# Altium schematic sheet IPMC_UnderTesting.SchDoc
size A3; Author: Marcelo Vicente; Organization: Univ. of Wisconsin-Madison; Address1: Madison, WI 53706; DocumentNumber: 3; SheetNumber: 3; SheetTotal: 5
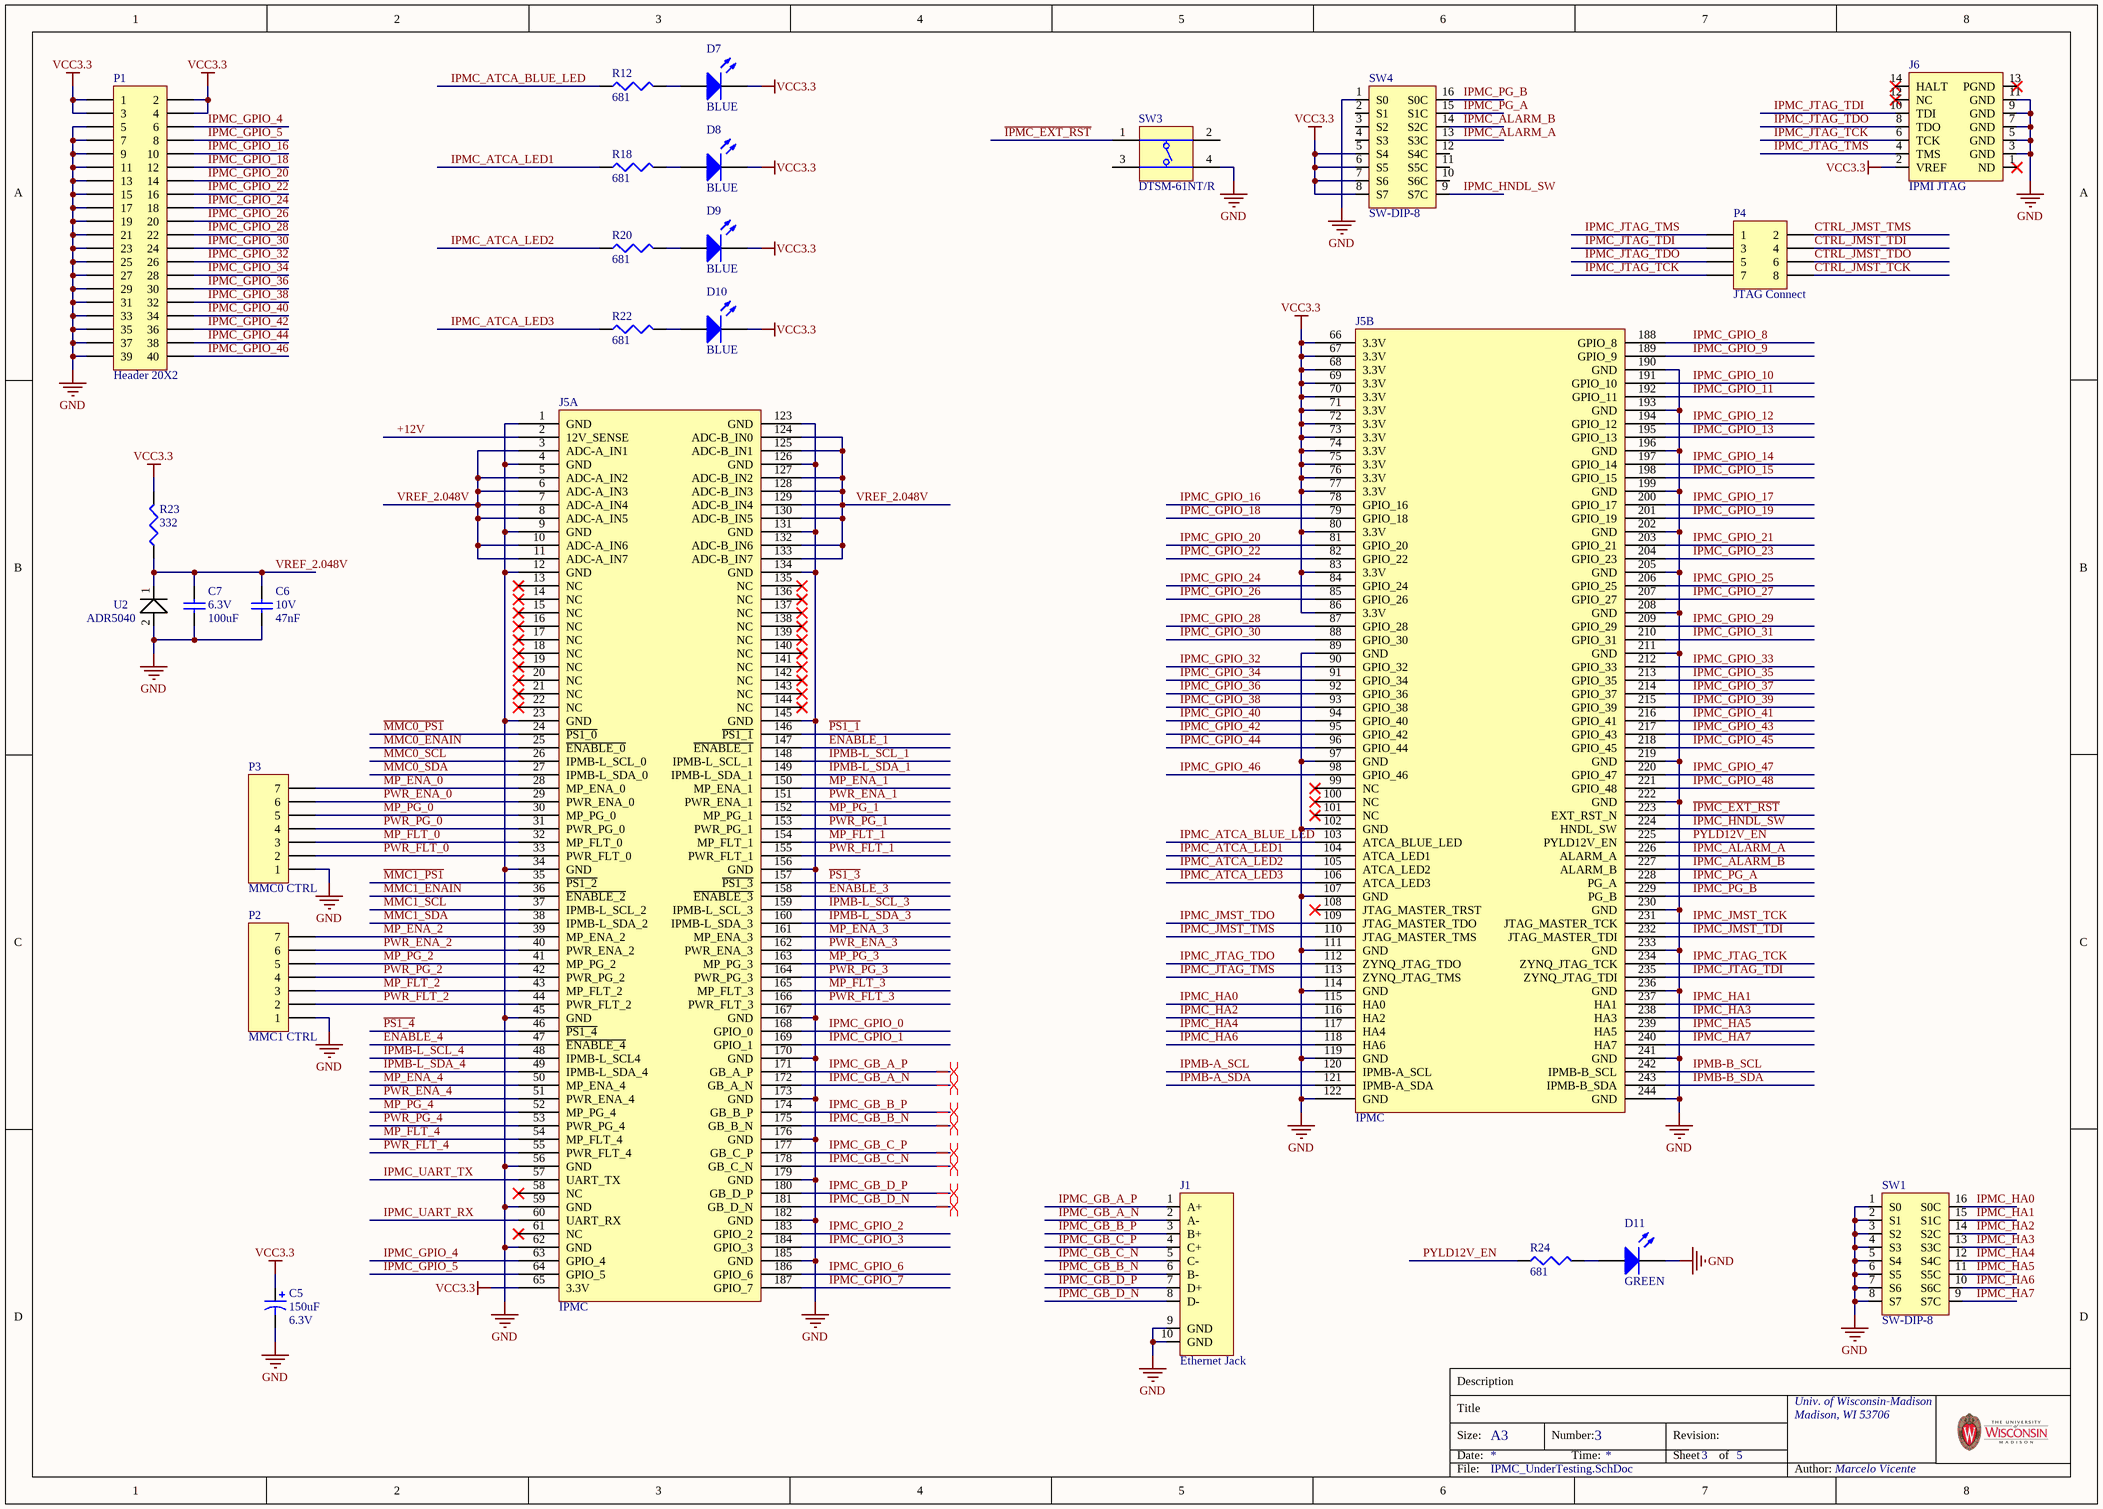
[diagram p0: IPMC_UnderTesting.SchDoc]

## Parts
C5  value 150uF  Rating: 6.3V  [VISH-293D-7343-31_V]  (hidden comment: ?)
C6  value 47nF  Rating: 10V  [C0402_IPC_H]  (hidden comment: ?)
C7  value 100uF  Rating: 6.3V  [C1210_IPC_H]  (hidden comment: ?)
D7  BLUE  [LED0603_M]
D8  BLUE  [LED0603_M]
D9  BLUE  [LED0603_M]
D10  BLUE  [LED0603_M]
D11  GREEN  [LED0603_M]
J1  Ethernet Jack  [43202-8916]
J5  IPMC  [87782-3007]  (parts A,B of 2)
J6  IPMI JTAG  [87832-1420]
P1  Header 20X2  [HEADER2X20]
P2  MMC1 CTRL  [HEADER1X7]
P3  MMC0 CTRL  [HEADER1X7]
P4  JTAG Connect  [HEADER2X4]
R12  value 681  [R0603]  (hidden comment: ?)
R18  value 681  [R0603]  (hidden comment: ?)
R20  value 681  [R0603]  (hidden comment: ?)
R22  value 681  [R0603]  (hidden comment: ?)
R23  value 332  [R0402_IPC_H]  (hidden comment: ?)
R24  value 681  [R0603]  (hidden comment: ?)
SW1  SW-DIP-8  [TDA08H0]
SW3  DTSM-61NT/R  [DIPT-DTSM-6_V]
SW4  SW-DIP-8  [TDA08H0]
U2  ADR5040  [SOT23-H]

## Nets
GND: C5.2 C6.1 C7.1 D11.2(K) J1.9(GND) J1.10(GND) J5.1(GND) J5.4(GND) J5.9(GND) J5.12(GND) J5.23(GND) J5.34(GND) J5.45(GND) J5.56(GND) J5.59(GND) J5.62(GND) J5.89(GND) J5.97(GND) J5.102(GND) J5.107(GND) J5.111(GND) J5.114(GND) J5.119(GND) J5.122(GND) J5.123(GND) J5.126(GND) J5.131(GND) J5.134(GND) J5.145(GND) J5.156(GND) J5.167(GND) J5.170(GND) J5.173(GND) J5.176(GND) J5.179(GND) J5.182(GND) J5.185(GND) J5.190(GND) J5.193(GND) J5.196(GND) J5.199(GND) J5.202(GND) J5.205(GND) J5.208(GND) J5.211(GND) J5.219(GND) J5.222(GND) J5.230(GND) J5.233(GND) J5.236(GND) J5.241(GND) J5.244(GND) J6.3(GND) J6.5(GND) J6.7(GND) J6.9(GND) J6.11(GND) P1.5 P1.7 P1.9 P1.11 P1.13 P1.15 P1.17 P1.19 P1.21 P1.23 P1.25 P1.27 P1.29 P1.31 P1.33 P1.35 P1.37 P1.39 P2.1 P3.1 SW1.1(S0) SW1.2(S1) SW1.3(S2) SW1.4(S3) SW1.5(S4) SW1.6(S5) SW1.7(S6) SW1.8(S7) SW3.4(T3) SW4.1(S0) U2.2(V+)
VCC3.3: C5.1 D7.2(K) D8.2(K) D9.2(K) D10.2(K) J5.65(3.3V) J5.66(3.3V) J5.67(3.3V) J5.68(3.3V) J5.69(3.3V) J5.70(3.3V) J5.71(3.3V) J5.72(3.3V) J5.73(3.3V) J5.74(3.3V) J5.75(3.3V) J5.76(3.3V) J5.77(3.3V) J5.80(3.3V) J5.83(3.3V) J5.86(3.3V) J6.2(VREF) P1.1 P1.2 P1.3 P1.4 R23.2 SW4.5(S4) SW4.6(S5) SW4.7(S6) SW4.8(S7)
+12V: J5.2(12V_SENSE)
~{ENABLE_1}: J5.147(~{ENABLE_1})
~{ENABLE_3}: J5.158(~{ENABLE_3})
~{ENABLE_4}: J5.47(~{ENABLE_4})
~{IPMC_EXT_RST}: J5.223(EXT_RST_N) SW3.1(T1)
~{MMC0_ENAIN}: J5.25(~{ENABLE_0})
~{MMC0_PS1}: J5.24(~{PS1_0})
~{MMC1_ENAIN}: J5.36(~{ENABLE_2})
~{MMC1_PS1}: J5.35(~{PS1_2})
~{PS1_1}: J5.146(~{PS1_1})
~{PS1_3}: J5.157(~{PS1_3})
~{PS1_4}: J5.46(~{PS1_4})
CTRL_JMST_TCK: P4.8
CTRL_JMST_TDI: P4.4
CTRL_JMST_TDO: P4.6
CTRL_JMST_TMS: P4.2
IPMB-A_SCL: J5.120(IPMB-A_SCL)
IPMB-A_SDA: J5.121(IPMB-A_SDA)
IPMB-B_SCL: J5.242(IPMB-B_SCL)
IPMB-B_SDA: J5.243(IPMB-B_SDA)
IPMB-L_SCL_1: J5.148(IPMB-L_SCL_1)
IPMB-L_SCL_3: J5.159(IPMB-L_SCL_3)
IPMB-L_SCL_4: J5.48(IPMB-L_SCL4)
IPMB-L_SDA_1: J5.149(IPMB-L_SDA_1)
IPMB-L_SDA_3: J5.160(IPMB-L_SDA_3)
IPMB-L_SDA_4: J5.49(IPMB-L_SDA_4)
IPMC_ALARM_A: J5.226(ALARM_A) SW4.13(S3C)
IPMC_ALARM_B: J5.227(ALARM_B) SW4.14(S2C)
IPMC_ATCA_BLUE_LED: J5.103(ATCA_BLUE_LED) R12.1
IPMC_ATCA_LED1: J5.104(ATCA_LED1) R18.1
IPMC_ATCA_LED2: J5.105(ATCA_LED2) R20.1
IPMC_ATCA_LED3: J5.106(ATCA_LED3) R22.1
IPMC_GB_A_N: J1.2(A-) J5.172(GB_A_N)
IPMC_GB_A_P: J1.1(A+) J5.171(GB_A_P)
IPMC_GB_B_N: J1.6(B-) J5.175(GB_B_N)
IPMC_GB_B_P: J1.3(B+) J5.174(GB_B_P)
IPMC_GB_C_N: J1.5(C-) J5.178(GB_C_N)
IPMC_GB_C_P: J1.4(C+) J5.177(GB_C_P)
IPMC_GB_D_N: J1.8(D-) J5.181(GB_D_N)
IPMC_GB_D_P: J1.7(D+) J5.180(GB_D_P)
IPMC_GPIO_0: J5.168(GPIO_0)
IPMC_GPIO_1: J5.169(GPIO_1)
IPMC_GPIO_2: J5.183(GPIO_2)
IPMC_GPIO_3: J5.184(GPIO_3)
IPMC_GPIO_4: J5.63(GPIO_4) P1.6
IPMC_GPIO_5: J5.64(GPIO_5) P1.8
IPMC_GPIO_6: J5.186(GPIO_6)
IPMC_GPIO_7: J5.187(GPIO_7)
IPMC_GPIO_8: J5.188(GPIO_8)
IPMC_GPIO_9: J5.189(GPIO_9)
IPMC_GPIO_10: J5.191(GPIO_10)
IPMC_GPIO_11: J5.192(GPIO_11)
IPMC_GPIO_12: J5.194(GPIO_12)
IPMC_GPIO_13: J5.195(GPIO_13)
IPMC_GPIO_14: J5.197(GPIO_14)
IPMC_GPIO_15: J5.198(GPIO_15)
IPMC_GPIO_16: J5.78(GPIO_16) P1.10
IPMC_GPIO_17: J5.200(GPIO_17)
IPMC_GPIO_18: J5.79(GPIO_18) P1.12
IPMC_GPIO_19: J5.201(GPIO_19)
IPMC_GPIO_20: J5.81(GPIO_20) P1.14
IPMC_GPIO_21: J5.203(GPIO_21)
IPMC_GPIO_22: J5.82(GPIO_22) P1.16
IPMC_GPIO_23: J5.204(GPIO_23)
IPMC_GPIO_24: J5.84(GPIO_24) P1.18
IPMC_GPIO_25: J5.206(GPIO_25)
IPMC_GPIO_26: J5.85(GPIO_26) P1.20
IPMC_GPIO_27: J5.207(GPIO_27)
IPMC_GPIO_28: J5.87(GPIO_28) P1.22
IPMC_GPIO_29: J5.209(GPIO_29)
IPMC_GPIO_30: J5.88(GPIO_30) P1.24
IPMC_GPIO_31: J5.210(GPIO_31)
IPMC_GPIO_32: J5.90(GPIO_32) P1.26
IPMC_GPIO_33: J5.212(GPIO_33)
IPMC_GPIO_34: J5.91(GPIO_34) P1.28
IPMC_GPIO_35: J5.213(GPIO_35)
IPMC_GPIO_36: J5.92(GPIO_36) P1.30
IPMC_GPIO_37: J5.214(GPIO_37)
IPMC_GPIO_38: J5.93(GPIO_38) P1.32
IPMC_GPIO_39: J5.215(GPIO_39)
IPMC_GPIO_40: J5.94(GPIO_40) P1.34
IPMC_GPIO_41: J5.216(GPIO_41)
IPMC_GPIO_42: J5.95(GPIO_42) P1.36
IPMC_GPIO_43: J5.217(GPIO_43)
IPMC_GPIO_44: J5.96(GPIO_44) P1.38
IPMC_GPIO_45: J5.218(GPIO_45)
IPMC_GPIO_46: J5.98(GPIO_46) P1.40
IPMC_GPIO_47: J5.220(GPIO_47)
IPMC_GPIO_48: J5.221(GPIO_48)
IPMC_HA0: J5.115(HA0) SW1.16(S0C)
IPMC_HA1: J5.237(HA1) SW1.15(S1C)
IPMC_HA2: J5.116(HA2) SW1.14(S2C)
IPMC_HA3: J5.238(HA3) SW1.13(S3C)
IPMC_HA4: J5.117(HA4) SW1.12(S4C)
IPMC_HA5: J5.239(HA5) SW1.11(S5C)
IPMC_HA6: J5.118(HA6) SW1.10(S6C)
IPMC_HA7: J5.240(HA7) SW1.9(S7C)
IPMC_HNDL_SW: J5.224(HNDL_SW) SW4.9(S7C)
IPMC_JMST_TCK: J5.231(JTAG_MASTER_TCK)
IPMC_JMST_TDI: J5.232(JTAG_MASTER_TDI)
IPMC_JMST_TDO: J5.109(JTAG_MASTER_TDO)
IPMC_JMST_TMS: J5.110(JTAG_MASTER_TMS)
IPMC_JTAG_TCK: J5.234(ZYNQ_JTAG_TCK) J6.6(TCK) P4.7
IPMC_JTAG_TDI: J5.235(ZYNQ_JTAG_TDI) J6.10(TDI) P4.3
IPMC_JTAG_TDO: J5.112(ZYNQ_JTAG_TDO) J6.8(TDO) P4.5
IPMC_JTAG_TMS: J5.113(ZYNQ_JTAG_TMS) J6.4(TMS) P4.1
IPMC_PG_A: J5.228(PG_A) SW4.15(S1C)
IPMC_PG_B: J5.229(PG_B) SW4.16(S0C)
IPMC_UART_RX: J5.60(UART_RX)
IPMC_UART_TX: J5.57(UART_TX)
MMC0_SCL: J5.26(IPMB-L_SCL_0)
MMC0_SDA: J5.27(IPMB-L_SDA_0)
MMC1_SCL: J5.37(IPMB-L_SCL_2)
MMC1_SDA: J5.38(IPMB-L_SDA_2)
MP_ENA_0: J5.28(MP_ENA_0) P3.7
MP_ENA_1: J5.150(MP_ENA_1)
MP_ENA_2: J5.39(MP_ENA_2) P2.7
MP_ENA_3: J5.161(MP_ENA_3)
MP_ENA_4: J5.50(MP_ENA_4)
MP_FLT_0: J5.32(MP_FLT_0) P3.3
MP_FLT_1: J5.154(MP_FLT_1)
MP_FLT_2: J5.43(MP_FLT_2) P2.3
MP_FLT_3: J5.165(MP_FLT_3)
MP_FLT_4: J5.54(MP_FLT_4)
MP_PG_0: J5.30(MP_PG_0) P3.5
MP_PG_1: J5.152(MP_PG_1)
MP_PG_2: J5.41(MP_PG_2) P2.5
MP_PG_3: J5.163(MP_PG_3)
MP_PG_4: J5.52(MP_PG_4)
PWR_ENA_0: J5.29(PWR_ENA_0) P3.6
PWR_ENA_1: J5.151(PWR_ENA_1)
PWR_ENA_2: J5.40(PWR_ENA_2) P2.6
PWR_ENA_3: J5.162(PWR_ENA_3)
PWR_ENA_4: J5.51(PWR_ENA_4)
PWR_FLT_0: J5.33(PWR_FLT_0) P3.2
PWR_FLT_1: J5.155(PWR_FLT_1)
PWR_FLT_2: J5.44(PWR_FLT_2) P2.2
PWR_FLT_3: J5.166(PWR_FLT_3)
PWR_FLT_4: J5.55(PWR_FLT_4)
PWR_PG_0: J5.31(PWR_PG_0) P3.4
PWR_PG_1: J5.153(PWR_PG_1)
PWR_PG_2: J5.42(PWR_PG_2) P2.4
PWR_PG_3: J5.164(PWR_PG_3)
PWR_PG_4: J5.53(PWR_PG_4)
PYLD12V_EN: J5.225(PYLD12V_EN) R24.1
VREF_2.048V: C6.2 C7.2 J5.3(ADC-A_IN1) J5.5(ADC-A_IN2) J5.6(ADC-A_IN3) J5.7(ADC-A_IN4) J5.8(ADC-A_IN5) J5.10(ADC-A_IN6) J5.11(ADC-A_IN7) J5.124(ADC-B_IN0) J5.125(ADC-B_IN1) J5.127(ADC-B_IN2) J5.128(ADC-B_IN3) J5.129(ADC-B_IN4) J5.130(ADC-B_IN5) J5.132(ADC-B_IN6) J5.133(ADC-B_IN7) R23.1 U2.1(V+)
NetD7_1: D7.1(A) R12.2
NetD8_1: D8.1(A) R18.2
NetD9_1: D9.1(A) R20.2
NetD10_1: D10.1(A) R22.2
NetD11_1: D11.1(A) R24.2

Not connected (* = marked no-connect by the designer): J5 13(NC)* 14(NC)* 15(NC)* 16(NC)* 17(NC)* 18(NC)* 19(NC)* 20(NC)* 21(NC)* 22(NC)* 58(NC)* 61(NC)* 99(NC)* 100(NC)* 101(NC)* 108(JTAG_MASTER_TRST)* 135(NC)* 136(NC)* 137(NC)* 138(NC)* 139(NC)* 140(NC)* 141(NC)* 142(NC)* 143(NC)* 144(NC)*; J6 1(ND)* 12(NC)* 13(PGND)* 14(HALT)*; SW3 2(T2) 3(T3); SW4 2(S1) 3(S2) 4(S3) 10(S6C) 11(S5C) 12(S4C)

## Layout directives
differential pair: IPMC_GB_A_N, IPMC_GB_A_P, IPMC_GB_B_N, IPMC_GB_B_P, IPMC_GB_C_N, IPMC_GB_C_P, IPMC_GB_D_N, IPMC_GB_D_P

## Notes on the sheet
- Description
- Title
- Size:
- Date:
- A3
- Number:
- Time:
- Revision:
- Sheet
- of
- File:
- Author:

## Library data of the parts
C5 = Cap Pol3: Polarized Capacitor (Surface Mount); Mfg. Part No.: A700X157M006ATE015; INVKEY: CP7343-150uF-6.3V-ESR15-20%; Mfgr: Kemet
C6 = Cap: Capacitor; Mfg. Part No.: ECJ-0EB1A473K; INVKEY: CP0402-47NF-10V-10%; Mfgr: Panasonic-ECJ
C7 = Cap: Capacitor; Mfg. Part No.: GRM32ER60J107ME20L; INVKEY: CP1210-100UF-6.3V-20%; Mfgr: Murata
D7-D10 = LED: Light Emitting Diode; Mfg. Part No.: LTST-S270TBKT; INVKEY: LED-BL-RA-0603; Mfgr: Lite-On; Value: BLUE
D11 = LED: Light Emitting Diode; Mfg. Part No.: LTST-S270KGKT; INVKEY: LED-GRN-RA-UB-0603; Mfgr: Lite-On; Value: GREEN
J1 = Ethernet Jack: RJ45 Ethernet Jack; INVKEY: CO-43202-8916; Mfgr: Molex; Mfg. Part No.: 43202-8916
J5 = IPMC: Molex 87782-3007; Note: Compatible with Molex 87782-3003, 87782-3005, 87782-3007 and 87782-3009; INVKEY: ?; Mfg. Part No.: 87782-3007; Mfgr: Molex
J6 = Xilinx JTAG Header: Molex 87832-1420; INVKEY: CO-PIN-HDR-2X7SS-2MM; Mfg. Part No.: 87832-1420; Mfgr: Molex
P1 = Header 20X2: Header, 20-Pin, Dual row; Note: Do not assemble; INVKEY: ?; Mfg. Part No.: ?; Mfgr: ?
P2 P3 = Header 7: Header, 7-Pin; Note: Do not assemble; INVKEY: ?; Mfg. Part No.: ?; Mfgr: ?
P4 = Header 4X2: Header, 4-Pin, Dual row; INVKEY: ?; Mfg. Part No.: ?; Mfgr: ?
R12 R18 R20 R22 R24 = Res: Resistor; Mfg. Part No.: RC0603FR-07681RL; Tolerance: 1%; INVKEY: RS0603-681R-1/10W-1%; Mfgr: Yageo
R23 = Res: Resistor; Tolerance: 1%; INVKEY: ?; Mfg. Part No.: ?; Mfgr: ?
SW1 SW4 = SW-DIP-8: C&K TDA08H0SB1R; Mfg. Part No.: TDA08HOSB1; INVKEY: SW-DIP-8X-SMD; Mfgr: C&K
SW3 = CMP-0306-00001-1: Switch, SPNO Push Button SMD; INVKEY: ?; Mfg. Part No.: ?; Mfgr: ?
U2 = ADR5040: Precision Micropower Shunt Mode; Mfg. Part No.: ADR5040ARTZ; INVKEY: VREF-ADR5040A-SOT23; Mfgr: Analog Devices